# Altium schematic sheet ATB-Basics-PartB.SchDoc
size A4
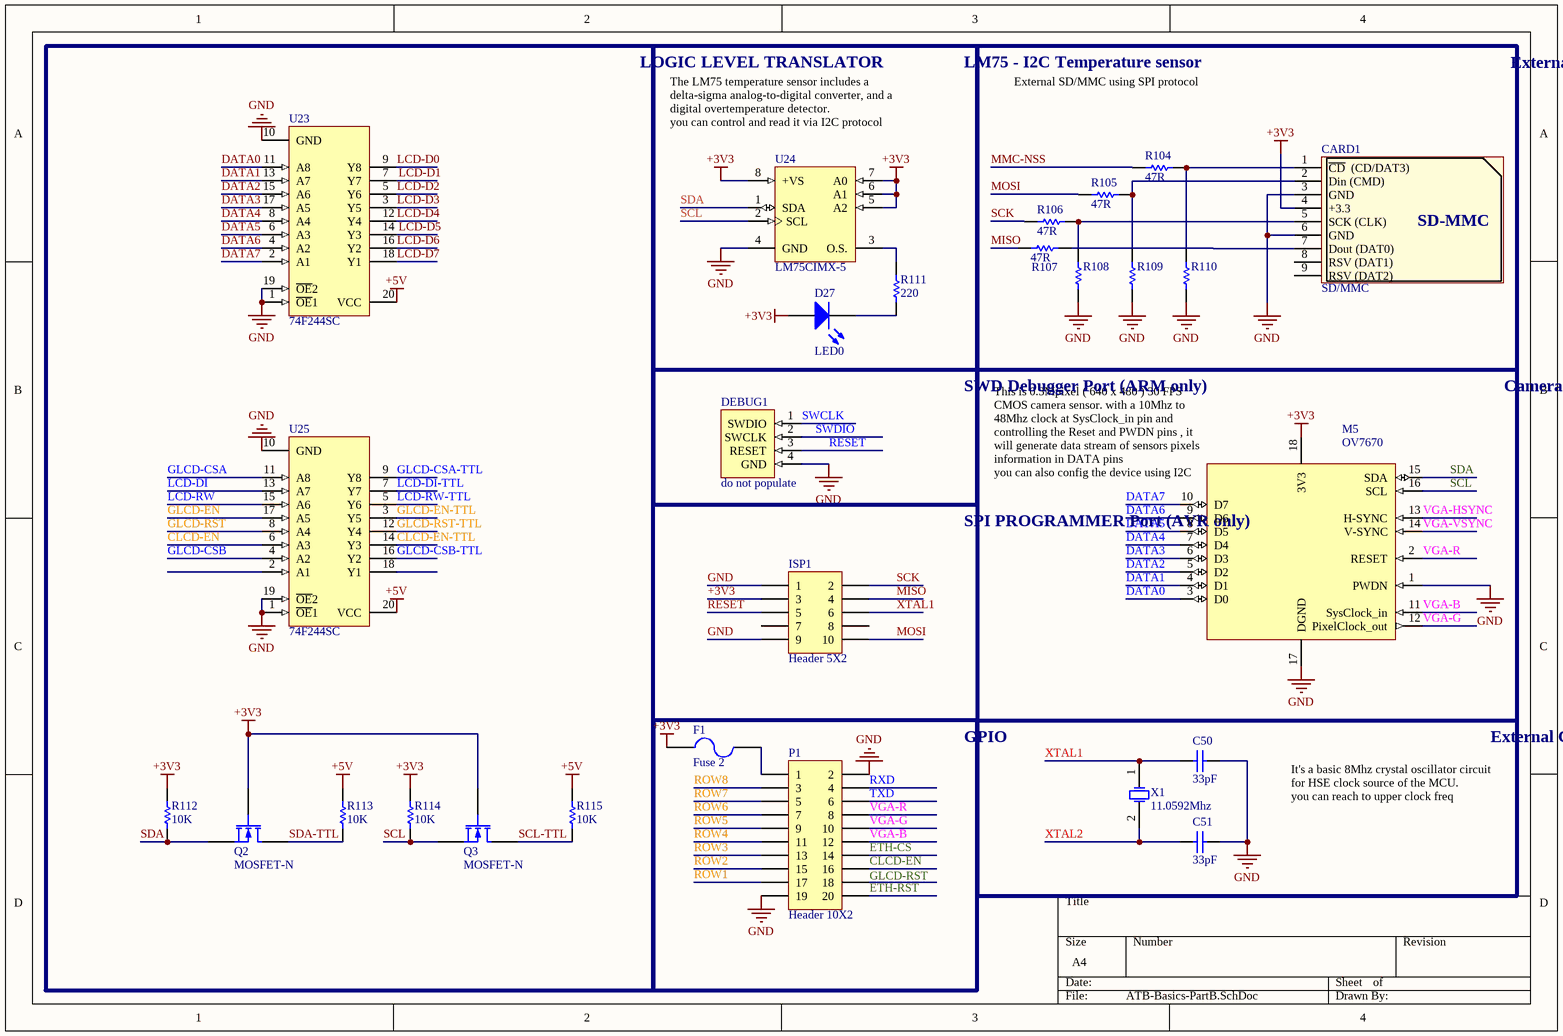
[diagram p0: ATB-Basics-PartB.SchDoc]

## Parts
C50  33pF  [SMD_R0805]
C51  33pF  [SMD_R0805]
CARD1  SD/MMC  [SD/MMC  Connector]
D27  LED0  [3.5X2.8X1.9]
DEBUG1  do not populate  [SWD-PORT]
F1  Fuse 2  [SelfFuse-1206]  (no BOM)
ISP1  Header 5X2  [HDR2X5]
M5  OV7670  [OV7670]
P1  Header 10X2  [HDR2X10]
Q2  MOSFET-N  [TR_P3]
Q3  MOSFET-N  [TR_P3]
R104  47R  [SMD_R0805]
R105  47R  [SMD_R0805]
R106  47R  [SMD_R0805]
R107  47R  [SMD_R0805]
R108  DNI  [SMD_R0805]  (value not drawn)
R109  DNI  [SMD_R0805]  (value not drawn)
R110  DNI  [SMD_R0805]  (value not drawn)
R111  220  [SMD_R0805]
R112  10K  [SMD_R0805]
R113  10K  [SMD_R0805]
R114  10K  [SMD_R0805]
R115  10K  [SMD_R0805]
U23  74F244SC  [751D-04_N]
U24  LM75CIMX-5  [M08A_M]
U25  74F244SC  [751D-04_N]
X1  11.0592Mhz  [XTALL]

## Blocks framed on the sheet
LOGIC LEVEL TRANSLATOR: Q2 Q3 R112-R115 U23 U25
LM75 - I2C Temperature sensor: D27 R111 U24
External Memory: CARD1 R104-R110
SWD Debugger Port (ARM only): DEBUG1
Camera Module - OV7670: M5
GPIO: F1 P1
External Clock - HSE: C50 C51 X1

## Nets
+3V3: CARD1.4(+3.3) D27.1(A) F1.1 ISP1.3 M5.18(3V3) Q2.2(G) Q3.2(G) R112.2 R114.2 U24.5(A2) U24.6(A1) U24.7(A0) U24.8(+VS)
+5V: R113.2 R115.2 U23.20(VCC) U25.20(VCC)
GND: C50.1 C51.2 CARD1.3(GND) CARD1.6(GND) DEBUG1.4(GND) ISP1.1 ISP1.9 M5.1(PWDN) M5.17(DGND) P1.2 P1.19 R108.1 R109.1 R110.1 U23.1(~{OE}1) U23.10(GND) U23.19(~{OE}2) U24.4(GND) U25.1(~{OE}1) U25.10(GND) U25.19(~{OE}2)
CLCD-EN: P1.16 U25.6(A3)
CLCD-EN-TTL: U25.14(Y3)
DATA0: M5.3(D0) U23.11(A8)
DATA1: M5.4(D1) U23.13(A7)
DATA2: M5.5(D2) U23.15(A6)
DATA3: M5.6(D3) U23.17(A5)
DATA4: M5.7(D4) U23.8(A4)
DATA5: M5.8(D5) U23.6(A3)
DATA6: M5.9(D6) U23.4(A2)
DATA7: M5.10(D7) U23.2(A1)
ETH-CS: P1.14
ETH-RST: P1.20
GLCD-CSA: U25.11(A8)
GLCD-CSA-TTL: U25.9(Y8)
GLCD-CSB: U25.4(A2)
GLCD-CSB-TTL: U25.16(Y2)
GLCD-EN: U25.17(A5)
GLCD-EN-TTL: U25.3(Y5)
GLCD-RST: U25.8(A4)
GLCD-RST-TTL: U25.12(Y4)
LCD-D0: U23.9(Y8)
LCD-D1: U23.7(Y7)
LCD-D2: U23.5(Y6)
LCD-D3: U23.3(Y5)
LCD-D4: U23.12(Y4)
LCD-D5: U23.14(Y3)
LCD-D6: U23.16(Y2)
LCD-D7: U23.18(Y1)
LCD-DI: U25.13(A7)
LCD-DI-TTL: U25.7(Y7)
LCD-RW: U25.15(A6)
LCD-RW-TTL: U25.5(Y6)
MISO: ISP1.4 R107.1
MMC-NSS: R104.1
MOSI: ISP1.10 R105.1
RESET: DEBUG1.3(RESET) ISP1.5
ROW1: P1.17
ROW2: P1.15
ROW3: P1.13
ROW4: P1.11
ROW5: P1.9
ROW6: P1.7
ROW7: P1.5
ROW8: P1.3
RXD: P1.4
SCK: ISP1.2 R106.1
SCL: M5.16(SCL) Q3.3(S) R114.1 U24.2(SCL)
SCL-TTL: Q3.1(D) R115.1
SDA: M5.15(SDA) Q2.3(S) R112.1 U24.1(SDA)
SDA-TTL: Q2.1(D) R113.1
SWCLK: DEBUG1.1(SWDIO)
SWDIO: DEBUG1.2(SWCLK)
TXD: P1.6
VGA-B: M5.11(SysClock_in) P1.12
VGA-G: M5.12(PixelClock_out) P1.10
VGA-HSYNC: M5.13(H-SYNC)
VGA-R: M5.2(RESET) P1.8
VGA-VSYNC: M5.14(V-SYNC)
XTAL1: C50.2 ISP1.6 X1.1(OSC1)
XTAL2: C51.1 X1.2(OSC2)
NetCARD1_1: CARD1.1(~{CD}__(CD/DAT3)) CARD1.2(Din_(CMD)) CARD1.5(SCK_(CLK)) CARD1.7(Dout_(DAT0)) R104.2 R105.2 R106.2 R107.2 R108.2 R109.2 R110.2
NetD27_2: D27.2(K) R111.1
NetF1_2: F1.2 P1.1
NetR111_2: R111.2 U24.3(O.S.)

Not connected (* = marked no-connect by the designer): CARD1 8(RSV_(DAT1)) 9(RSV_(DAT2)); ISP1 7 8; P1 18; U25 2(A1) 18(Y1)

## Notes on the sheet
- External SD/MMC using SPI protocol
- (near U24) The LM75 temperature sensor includes a delta-sigma analog-to-digital converter, and a digital overtemperature detector.
  you can control and read it via I2C protocol
- (near M5) This is 0.3Mpixel ( 640 x 480 ) 30 FPS CMOS camera sensor. with a 10Mhz to 48Mhz clock at SysClock_in pin and controlling the Reset and PWDN pins , it will generate data stream of sensors pixels information in DATA pins
  you can also config the device using I2C
- SPI PROGRAMMER Port (AVR only)
- It's a basic 8Mhz crystal oscillator circuit for HSE clock source of the MCU.
  you can reach to upper clock freq
- Labels drawn without touching a wire or pin: GLCD-RST
- (in symbol MMC) SD-MMC

## Library data of the parts
C50 C51 = Cap: Capacitor; Published: 8-Jun-2000; LatestRevisionDate: 17-Jul-2002; LatestRevisionNote: Re-released for DXP Platform.; PackageReference: RAD-0.3; Publisher: Altium Limited; Value: 33pF
CARD1 = MMC
D27 = LED0: Typical INFRARED GaAs LED; Published: 8-Jun-2000; LatestRevisionDate: 08-Jul-2005; LatestRevisionNote: Mech Layer 1 removed.; PackageReference: LED-0; Publisher: Altium Limited
DEBUG1 = SWD-PORT: SWD debug and programming port
F1 = Fuse 2: Fuse; Published: 8-Jun-2000; LatestRevisionDate: 17-Jul-2002; LatestRevisionNote: Re-released for DXP Platform.; PackageReference: PIN-W2/E2.8; Publisher: Altium Limited; PackageDescription: Thru-Hole; 2 Leads
ISP1 = Header 5X2: Header, 5-Pin, Dual row; LatestRevisionDate: 17-Jul-2002; LatestRevisionNote: Re-released for DXP Platform.; Publisher: Altium Limited
M5 = CAM-OV7670: OV7670 CAMERA Module
P1 = Header 10X2: Header, 10-Pin, Dual row; LatestRevisionDate: 17-Jul-2002; LatestRevisionNote: Re-released for DXP Platform.; Publisher: Altium Limited
Q2 Q3 = MOSFET-N: N-Channel MOSFET; Published: 8-Jun-2000; LatestRevisionDate: 17-Jul-2002; LatestRevisionNote: Re-released for DXP Platform.; PackageVersion: 1995/1996; PackageReference: E3; Publisher: Altium Limited; PackageDescription: TO, Flat Index; 3 In-Line, Axial Leads; Body Dia. 4.6mm; Lead Dia. 0.5 mm (max)
R104-R115 = Res1: Resistor; Published: 8-Jun-2000; LatestRevisionDate: 17-Jul-2002; LatestRevisionNote: Re-released for DXP Platform.; PackageReference: AXIAL-0.3; Publisher: Altium Limited
  R104-R107: Value: 47R
  R108-R110: Value: DNI
  R111: Value: 220
  R112-R115: Value: 10K
U23 U25 = 74F244SC: Octal Buffer/Line Driver with Tri-State Output; Published: 15-Apr-2002; LatestRevisionDate: 13-Apr-2006; LatestRevisionNote: IPC-7351 Footprint Added.; DatasheetVersion: May-1995; PackageVersion: 2000; PackageReference: M20B; Publisher: Altium Limited; PackageDescription: 20-Pin Small Outline Integrated Circuit 1.27 mm Pitch; Code_JEDEC: MS-013-AC; Code_IPC: SOIC127P1030-20; ComponentLink1Description: Manufacturer Link; ComponentLink1URL: http://www.national.com/; ComponentLink2Description: Datasheet; ComponentLink2URL: http://www.fairchildsemi.com/ds/74/74F244.pdf; ComponentLink3Description: URL Link1; ComponentLink3URL: http://www.fairchildsemi.com/pf/74/74F244.html
U24 = CMP-0066-00058-2: Digital Temperature Sensor and Thermal Watchdog with Two-Wire Interface, 8 pin SOIC NARROW; Manufacturer: National Semiconductor; CompType: Temp Sensor IC; PackageTopMarking: NSZXTT*LM75*CIM5; PowerWise: N; Code_IPC: SOIC127P600-8; PackageVersion: revM, May-2009; ComponentLink3URL: http://www.national.com/packaging/folders/m08a.html; ComponentLink1URL: http://www.national.com/ds/LM/LM75C.pdf; ComponentLink2Description: LM75C Web Page; RoHS: N; PackageReference: M08A; Code_JEDEC: MS-012-AA; ComponentLink2URL: http://www.national.com/pf/LM/LM75C.html; PackageDescription: SOIC Narrow, 4.9 x 3.9 x 1.45mm, 8 Lead, 1.27mm Pitch; DatasheetVersion: Jul-2009; ComponentLink1Description: LM75C Datasheet; PinCount: 8; ComponentLink3Description: M08A Package Page; RevisionNote: Component URLs added
X1 = XTAL: Crystal Oscillator; Published: 8-Jun-2000; LatestRevisionDate: 17-Jul-2002; LatestRevisionNote: Re-released for DXP Platform.; PackageReference: R38; Publisher: Altium Limited